# EAGLE design Gesamtschaltplan (EAGLE 7.2.0)
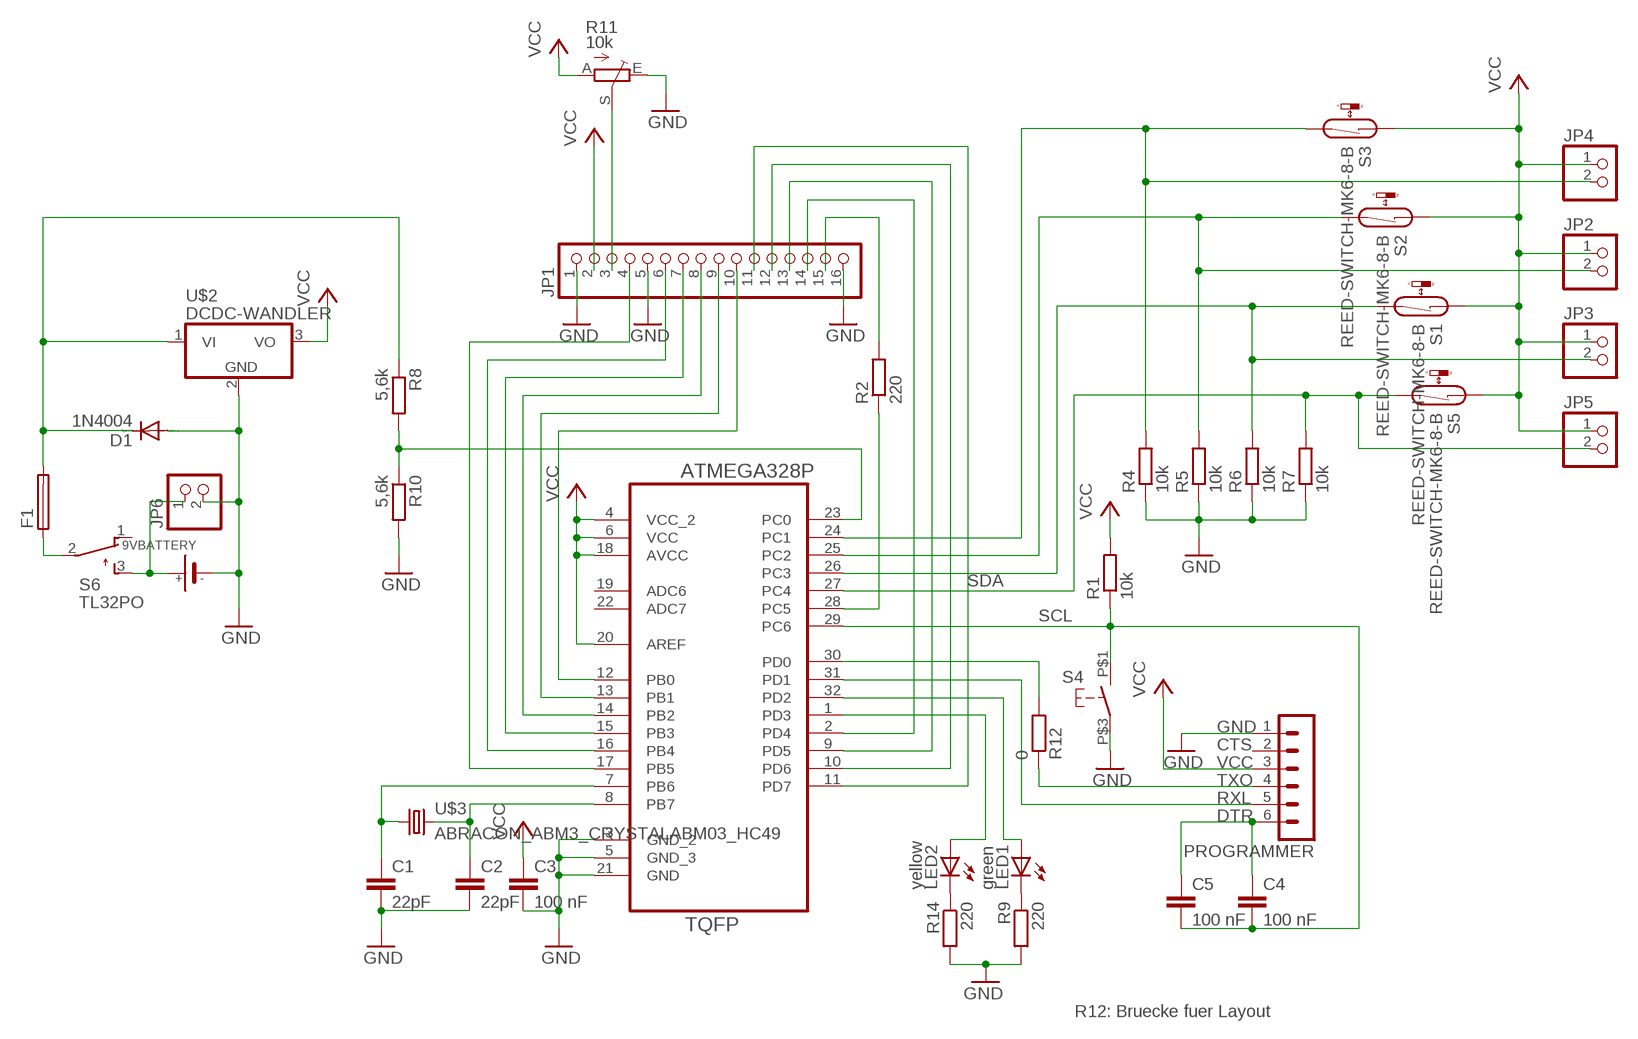
[diagram p0: schematic, sheet 1]

## Parts
C1  22pF  C-EUC0603K  [C0603K]
C2  22pF  C-EUC0603K  [C0603K]
C3  100 nF  C-EUC0603  [C0603]
C4  100 nF  C-EUC0603  [C0603]
C5  100 nF  C-EUC0603  [C0603]
D1  1N4004  [DO41-10]
F1  SH22,5A  [SH22,5A]
IC1  ATMEGA328P-AU  [QFP80P900X900X120-32N]
JP1  PINHD-1X16  [1X16]
JP2  PINHD-1X2  [1X02]
JP3  PINHD-1X2  [1X02]
JP4  PINHD-1X2  [1X02]
JP5  PINHD-1X2  [1X02]
JP6  PINHD-1X2  [1X02]
LED1  green  LED3MM  [LED3MM]
LED2  yellow  LED3MM  [LED3MM]
PROGRAMMER  MA06-1  [MA06-1]
R1  10k  R-EU_R1206  [R1206]
R2  220  R-EU_R1206  [R1206]
R4  10k  R-EU_R1206  [R1206]
R5  10k  R-EU_R1206  [R1206]
R6  10k  R-EU_R1206  [R1206]
R7  10k  R-EU_R1206  [R1206]
R8  5,6k  R-EU_R1206  [R1206]
R9  220  R-EU_R1206  [R1206]
R10  5,6k  R-EU_R1206  [R1206]
R11  10k  TRIM_EU-PT10  [PT-10]
R12  0  R-EU_R1206  [R1206]
R14  220  R-EU_R1206  [R1206]
S1  REED-SWITCH-MK6-8-B  [MK6-8-A]
S2  REED-SWITCH-MK6-8-B  [MK6-8-A]
S3  REED-SWITCH-MK6-8-B  [MK6-8-A]
S4  SCHLIESSER_TASTSCHALTER  [NAMAE-JTP-1130]
S5  REED-SWITCH-MK6-8-B  [MK6-8-A]
S6  TL32PO  [TL3XPO]
U$1  9VBATTERY  [BATTERIEHALTER-54X30]
U$2  DCDC-WANDLER  [TRACOPOWER-DCDCWANDER-TSR1]
U$3  ABRACON_ABM3_CRYSTALABM03_HC49  [ABM03_HC49]

## Nets
GND: C1.2 C2.2 C3.2 D1.A IC1.3(GND_2) IC1.5(GND_3) IC1.21(GND) JP1.1 JP1.5 JP1.16 JP6.2 PROGRAMMER.1 R4.1 R5.1 R6.1 R7.1 R9.2 R10.2 R11.E R14.2 S4.P$3 U$1.P$2 U$2.2(GND)
N$1: C4.2 C5.2 IC1.29(PC6) R1.1 S4.P$1
N$2: LED2.K(C) R14.1
N$3: C2.1 IC1.8(PB7) U$3.2
N$4: C1.1 IC1.7(PB6) U$3.1
N$5: IC1.2(PD4) JP1.14
N$6: F1.1 S6.2(P)
N$7: IC1.1(PD3) LED2.A
N$8: IC1.9(PD5) JP1.13
N$9: IC1.32(PD2) LED1.A
N$10: IC1.12(PB0) JP1.10
N$11: D1.C F1.2 R8.1 U$2.1(VI)
N$12: IC1.13(PB1) JP1.9
N$13: IC1.27(PC4) JP5.2 R7.2 S5.2
N$14: IC1.26(PC3) JP3.2 R6.2 S1.2
N$15: IC1.25(PC2) JP2.2 R5.2 S2.2
N$16: IC1.24(PC1) JP4.2 R4.2 S3.2
N$17: IC1.10(PD6) JP1.12
N$18: JP1.3 R11.S
N$19: JP6.1 S6.3(S) U$1.P$1
N$20: LED1.K(C) R9.1
N$21: IC1.11(PD7) JP1.11
N$22: PROGRAMMER.4 R12.1
N$23: IC1.14(PB2) JP1.8
N$24: IC1.15(PB3) JP1.7
N$25: IC1.16(PB4) JP1.6
N$26: IC1.17(PB5) JP1.4
N$28: IC1.23(PC0) R8.2 R10.1
N$30: C4.1 C5.1 PROGRAMMER.6
N$31: IC1.31(PD1) PROGRAMMER.5
N$44: IC1.28(PC5) R2.1
N$45: IC1.30(PD0) R12.2
N$46: JP1.15 R2.2
VCC: C3.1 IC1.4(VCC_2) IC1.6(VCC) IC1.18(AVCC) IC1.20(AREF) JP1.2 JP2.1 JP3.1 JP4.1 JP5.1 PROGRAMMER.3 R1.2 R11.A S1.1 S2.1 S3.1 S5.1 U$2.3(VO)
Unconnected: IC1.19(ADC6) IC1.22(ADC7) PROGRAMMER.2 S6.1(O)

## Notes on the sheet
- SDA
- SCL
- GND
- CTS
- VCC
- TXO
- RXL
- DTR
- R12: Bruecke fuer Layout

## Library data of the parts
C1-C5 = resistor:C-EU: CAPACITOR, European symbol
D1 = diode:1N4004: DIODE general purpose rectifier, 1 A
F1 = fuse:SH22,5A: FUSE HOLDER grid 22,5mm, isolated cap OGN0031 8201, Schurter (Buerklin); MPN: 0031.7701.11; OC_FARNELL: unknown; OC_NEWARK: 04F1224
IC1 = Ava:ATMEGA328P-AU; DESCRIPTION: 8-bit Microcontroller with In-System Programmable Flash; MPN: ATMEGA328P-AU; OC_FARNELL: 1715486; OC_NEWARK: 14R4631; PACKAGE: TQFP-32; SUPPLIER: Atmel
JP1 = pinhead:PINHD-1X16: PIN HEADER
JP2-JP6 = pinhead:PINHD-1X2: PIN HEADER
LED1 LED2 = led:LED: LED OSRAM: - CHIPLED LG R971, LG N971, LY N971, LG Q971, LY Q971, LO R971, LY R971 LH N974, LH R974 LS Q976, LO Q976, LY Q976 LO Q996 - Hyper CHIPLED LW Q18S LB Q993, LB Q99A, LB R99A - SideLED LS A670, LO A670, LY A670, LG A670, LP A670 LB A673, LV A673, LT A673, LW A673 LH A674 LY A675 LS A676, LA A676, LO A676, LY A676, LW A676 LS A679, LY A679, LG A679 - Hyper Micro SIDELED® LS Y876, LA Y876, LO Y876, LY Y876 LT Y87S - SmartLED LW L88C, LW L88S LB L89C, LB L89S, LG L890 LS L89K, LO L89K, LY L89K LS L896, LA L896, LO L896, LY L896 - TOPLED LS T670, LO T670, LY T670, LG T670, LP T670 LSG T670, LSP T670, LSY T670, LOP T670, LYG T670 LG T671, LOG T671, LSG T671 LB T673, LV T673, LT T673, LW T673 LH T674 LS T676, LA T676, LO T676, LY T676, LB T676, LH T676, LSB T676, LW T676 LB T67C, LV T67C, LT T67C, LS T67K, LO T67K, LY T67K, LW E67C LS E67B, LA E67B, LO E67B, LY E67B, LB E67C, LV E67C, LT E67C LW T67C LS T679, LY T679, LG T679 LS T770, LO T770, LY T770, LG T770, LP T770 LB T773, LV T773, LT T773, LW T773 LH T774 LS E675, LA E675, LY E675, LS T675 LS T776, LA T776, LO T776, LY T776, LB T776 LHGB T686 LT T68C, LB T68C - Hyper Mini TOPLED® LB M676 - Mini TOPLED Santana® LG M470 LS M47K, LO M47K, LY M47K Source: http://www.osram.convergy.de LUXEON: - LUMILED® LXK2-PW12-R00, LXK2-PW12-S00, LXK2-PW14-U00, LXK2-PW14-V00 LXK2-PM12-R00, LXK2-PM12-S00, LXK2-PM14-U00 LXK2-PE12-Q00, LXK2-PE12-R00, LXK2-PE12-S00, LXK2-PE14-T00, LXK2-PE14-U00 LXK2-PB12-K00, LXK2-PB12-L00, LXK2-PB12-M00, LXK2-PB14-N00, LXK2-PB14-P00, LXK2-PB14-Q00 LXK2-PR12-L00, LXK2-PR12-M00, LXK2-PR14-Q00, LXK2-PR14-R00 LXK2-PD12-Q00, LXK2-PD12-R00, LXK2-PD12-S00 LXK2-PH12-R00, LXK2-PH12-S00 LXK2-PL12-P00, LXK2-PL12-Q00, LXK2-PL12-R00 Source: www.luxeon.com KINGBRIGHT: KA-3528ASYC Source: www.kingbright.com
PROGRAMMER = con-lstb:MA06-1: PIN HEADER; OC_FARNELL: unknown; OC_NEWARK: unknown
R1 R2 R4-R10 R12 R14 = resistor:R-EU_: RESISTOR, European symbol
R11 = pot:TRIM_EU-: POTENTIOMETER
S1-S3 S5 = switch-reed:REED-SWITCH-: Reed Sensor; MF: MEDER; MPN: MK6-8-B; OC_FARNELL: 1079481
S4 = 0liver:SCHLIESSER_TASTSCHALTER: Tastschalter, Schließer
S6 = switch:TL32PO: TINY SWITCH ON - MOM Source: http://www2.produktinfo.conrad.com/datenblaetter/700000-724999/705152-da-01-de-Subminiaturschalter_TL_36YO.pdf
U$1 = 0liver:9VBATTERY
U$2 = 0liver:DCDC-WANDLER
U$3 = Ava:ABRACON_ABM3_CRYSTAL

## Board
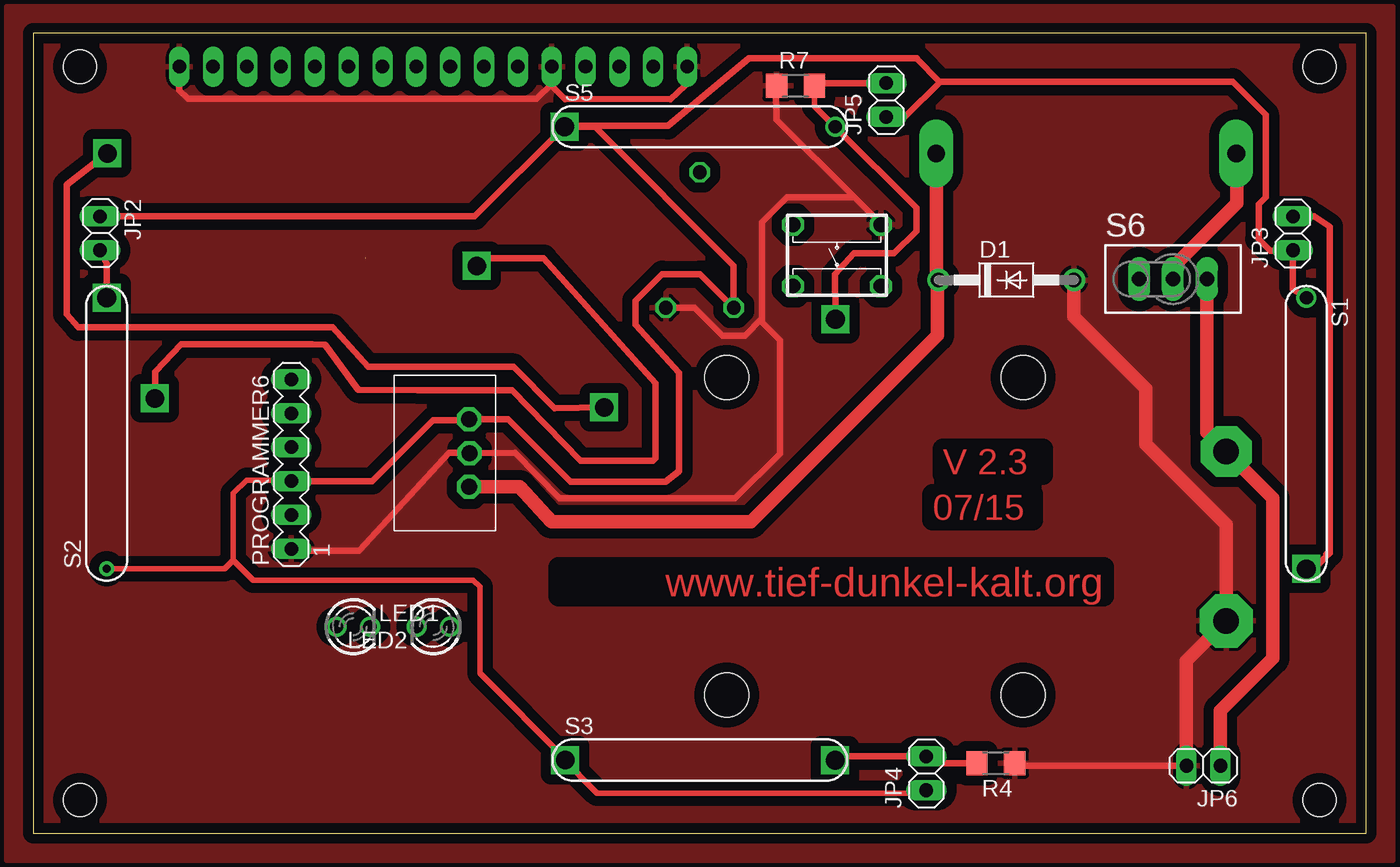
[diagram p1: board, top side]
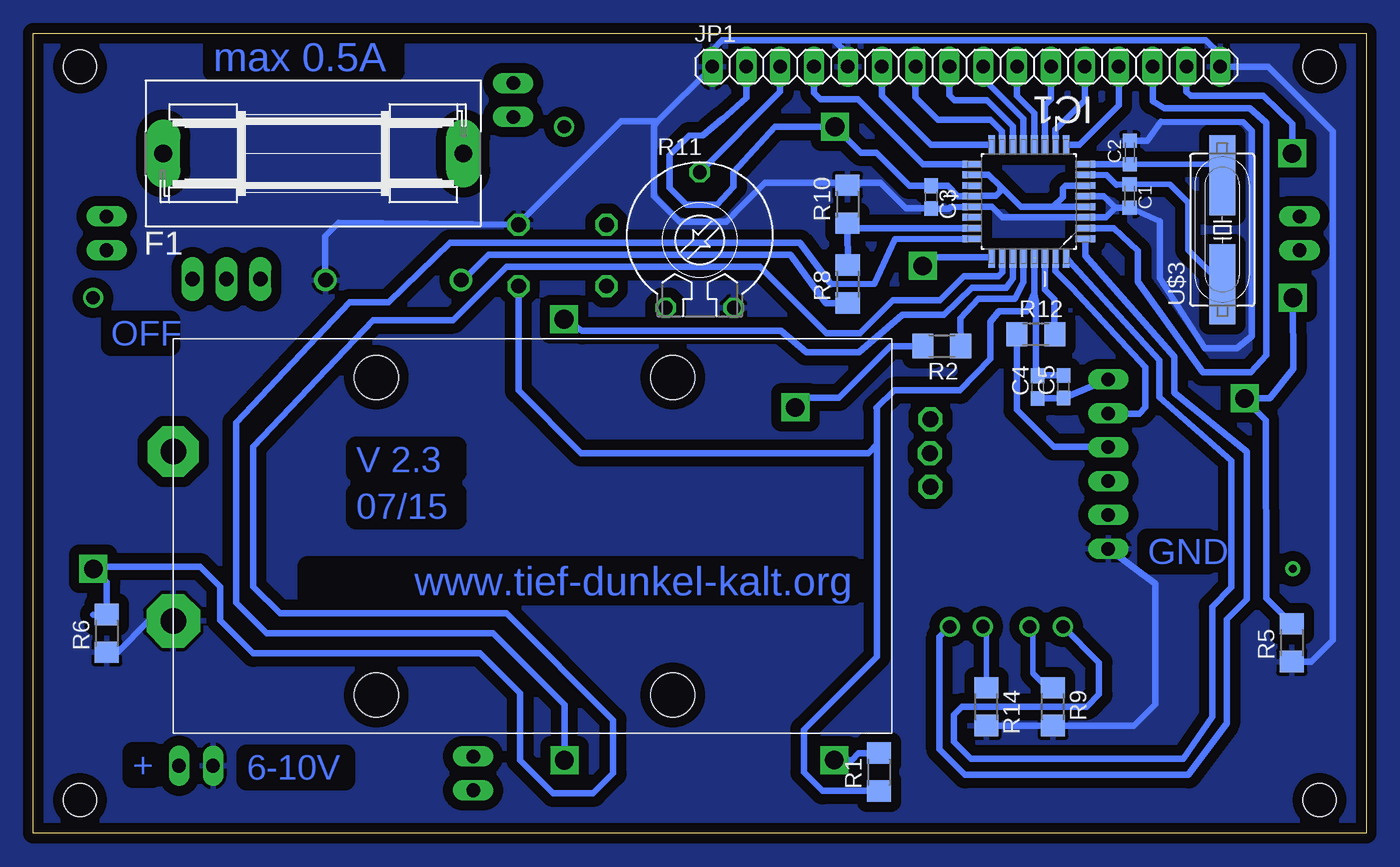
[diagram p2: board, bottom side, seen from below]

Size 100 x 60 mm. Coordinates in mm from the lower left corner, seen from the top.
Outline: 100,0 100,60 0,60 0,0 100,0
Copper layers (1*16): Top 0.035mm / dielectric 1.5mm / Bottom 0.035mm
Design rules "default *": minimum track width 10mil, minimum drill 24mil, track to track 30mil, track to pad 30mil, pad to pad 30mil, via to via 30mil, smd to smd 30mil, copper to edge 30mil, drill to drill 30mil, minimum pad ring 10mil, minimum via ring 8mil, stop-mask expansion 4mil, vias tented up to drill 0mil, thermal gap 10mil
Holes 2.5 mm at 96.5,2.5 3.5,2.5 3.5,2.5 96.5,57.5 3.5,57.5 3.5,2.5

### Footprints (pad centres in the part's own frame; a part is rotated, then mirrored left to right if it is on the bottom)
C0603K = smd 1.05 x 1.08: 1 -0.875,0; 2 0.875,0
C0603 = smd 1.1 x 1: 1 -0.85,0; 2 0.85,0
DO41-10 = drill 1.118: A 5.08,0; C -5.08,0
SH22,5A = drill 1.321 pad 2.54 long: 1 -11.252,0; 2 11.252,0
QFP80P900X900X120-32N = smd 1.473 x 0.508: 1 -4.242,2.794; 2 -4.242,2.007; 3 -4.242,1.194; 4 -4.242,0.406; 5 -4.242,-0.406; 6 -4.242,-1.194; 7 -4.242,-2.007; 8 -4.242,-2.794; 17 4.242,-2.794; 18 4.242,-2.007; 19 4.242,-1.194; 20 4.242,-0.406; 21 4.242,0.406; 22 4.242,1.194; 23 4.242,2.007; 24 4.242,2.794 | smd 0.508 x 1.473: 9 -2.794,-4.242; 10 -2.007,-4.242; 11 -1.194,-4.242; 12 -0.406,-4.242; 13 0.406,-4.242; 14 1.194,-4.242; 15 2.007,-4.242; 16 2.794,-4.242; 25 2.794,4.242; 26 2.007,4.242; 27 1.194,4.242; 28 0.406,4.242; 29 -0.406,4.242; 30 -1.194,4.242; 31 -2.007,4.242; 32 -2.794,4.242
1X16 = drill 1.016 long: 1 -19.05,0; 2 -16.51,0; 3 -13.97,0; 4 -11.43,0; 5 -8.89,0; 6 -6.35,0; 7 -3.81,0; 8 -1.27,0; 9 1.27,0; 10 3.81,0; 11 6.35,0; 12 8.89,0; 13 11.43,0; 14 13.97,0; 15 16.51,0; 16 19.05,0
1X02 = drill 1.016 long: 1 -1.27,0; 2 1.27,0
LED3MM = drill 0.813 octagon: A -1.27,0; K 1.27,0
MA06-1 = drill 1.016 long: 1 -6.35,0; 2 -3.81,0; 3 -1.27,0; 4 1.27,0; 5 3.81,0; 6 6.35,0
R1206 = smd 1.6 x 1.803: 1 -1.422,0; 2 1.422,0
PT-10 = drill 1.016 octagon: A -2.54,-5.08; E 2.54,-5.08; S 0,5.08
MK6-8-A = drill 0.6 pad 1.016: 1 -10.16,0; 2 10.16,0
NAMAE-JTP-1130 = drill 1.1 octagon: P$1 3.3,-2.3; P$2 -3.3,-2.3; P$3 3.3,2.3; P$4 -3.3,2.3
TL3XPO = drill 1.1 pad 1.422 long: 1 -2.54,0; 2 0,0; 3 2.54,0
BATTERIEHALTER-54X30 = drill 1.92 pad 3.81 octagon: P$1 0,21.135 | drill 1.92 pad 4 octagon: P$2 0,8.435 | hole 3.3: 15.24,2.87; 37.47,2.87; 15.24,26.7; 37.47,26.7
TRACOPOWER-DCDCWANDER-TSR1 = drill 0.6 square: 1 0,0; 2 2.54,0; 3 5.08,0
ABM03_HC49 = smd 6 x 1.93: 1 -4.1,0; 2 4.1,0

### Placement (x,y rotation side)
C1  17.75,47.81 270 bottom
C2  17.73,51.06 90 bottom
C3  32.64,47.72 270 bottom
C4  24.65,33.47 90 bottom
C5  22.71,33.5 90 bottom
D1  73,41.5 0 top
F1  79,51 0 bottom
IC1  25.31,47.39 180 bottom
JP1  30,57.5 0 bottom
JP2  5.01,45 270 top
JP3  94.5,45 90 top
JP4  67,4.5 90 top
JP5  64,55 90 top
JP6  87.79,5.07 180 top
LED1  24,15.5 0 top
LED2  30,15.5 180 top
PROGRAMMER  19.35,27.69 90 top
R1  36.56,4.6 90 bottom
R2  31.84,36.55 180 bottom
R4  72.21,5.27 180 top
R5  5.58,14.3 90 bottom
R6  94.49,15 90 bottom
R7  57.19,56.06 0 top
R8  38.9,41.2 90 bottom
R9  23.5,9.5 270 bottom
R10  38.91,47.18 90 bottom
R11  50,44.5 0 bottom
R12  24.78,37.42 0 bottom
R14  28.5,9.5 270 bottom
S1  95.5,30 270 top
S2  5.5,30 90 top
S3  50,5.5 0 top
S4  60.29,43.34 0 top
S5  50,53 0 top
S6  85.51,41.57 0 top
U$1  89.5,7.5 0 bottom
U$2  32.69,25.98 90 top
U$3  10.79,45.27 90 bottom

### Tracks (layer width: path | path; a pad name or v marks a point on that pad's centre or on a via)
GND
  Top 0.5: S4.P$3 63.52,45.78 61.61,47.69 | 61.61,47.69 55.77,53.53 55.72,55.93 R7.1 | PROGRAMMER.1 19.49,21.2 24.43,21.2 31.19,28.54 32.69,28.54 U$2.2 32.66,28.52 36.16,28.54 39.49,25.12 52.65,25.12 56,28.47 56,37 54.68,38.32 54.68,38.63 | R11.E 49.62,39.42 51.71,37.33 53.38,37.33 54.68,38.63 | 54.68,38.63 54.68,45.84 56.53,47.69 61.61,47.69 | 10.95,57.37 10.95,55.75 11.62,55.08 37.75,55.08 38.9,56.23 38.9,56.03 39.89,55.04 | R4.1 73.83,5.07 JP6.2
  Top 1: D1.A 78.07,38.74 83.48,33.33 83.48,29.17 89.5,23.15 U$1.P$2 86.52,12.96 JP6.2
  Bottom 0.5: 18.82,46.94 C1.2 15.47,45.91 15.48,41.63 12.11,36.37 9.7,36.37 8.6,37.27 8.6,52.68 9.23,53.33 15.41,53.36 16.43,51.94 C2.2 | 18.82,46.94 19.55,46.2 IC1.3 27.29,46.2 28.08,46.98 29.54,46.98 IC1.21 31.21,46.97 31.33,46.86 C3.2 34.54,46.87 36.45,48.78 37.72,48.78 | IC1.5 19.68,47.8 18.82,46.94 | R14.2 R9.2 17.44,8.08 15.82,9.7 15.82,18.71 PROGRAMMER.1 | JP1.5 38.89,58.45 39.92,59.48 40.05,59.48 | 40.05,59.48 48.32,59.48 49.05,58.75 JP1.1 53.16,53.39 | 37.72,48.78 R10.2 | U$1.P$2 91.33,15.94 93.68,13.59 94.55,13.62 R6.1 | 53.16,53.39 55.91,53.39 63.52,45.78 S4.P$3 77.11,45.78 78.11,44.78 78.11,41.53 D1.A | 37.72,48.78 45.12,48.78 47.44,46.46 47.44,46.42 47.99,45.87 51.52,45.87 53.45,47.8 53.45,53.1 53.16,53.39 | 40.05,59.48 39.78,59.47 12.03,59.47 10.95,58.43 JP1.16 7.35,57.5 2.5,52.65 2.5,14.5 4.12,12.88 R5.1
  pour Top: -5,65 105,65 105,-5 -5,-5
  pour Bottom: -4,64 104,64 104,-4 -4,-4
N$1  (1 unrouted)
  Bottom 0.5: R1.1 40.79,3.18 42.2,4.59 42.19,4.6 42.19,7.77 36.7,13.26 36.7,29.18 | 24.89,40.45 24.79,39.89 24.77,34.3 24.73,34.63 C4.2 24.62,34.35 C5.2 | 24.89,40.45 24.95,40.42 25.45,39.17 27.56,39.17 28.19,38.36 28.19,35.61 30.48,33.22 35.41,33.22 36.76,31.93 36.7,31.93 36.7,29.18 | 36.7,29.18 37.36,28.52 58.9,28.52 63.6,33.22 S4.P$1 | IC1.29 24.89,40.45
N$2
  Bottom 0.406: R14.1 28.5,15.27 LED2.K
N$3
  Bottom 0.406: C2.1 10.94,50.18 10.92,50.2 10.92,49.5 U$3.2
  Bottom 0.5: IC1.8 C2.1
N$4
  Bottom 0.406: C1.1 14.75,48.68 13.39,47.32 13.39,43.77 U$3.1
  Bottom 0.5: IC1.7 19.45,49.37 18.73,48.65 C1.1
N$5
  Bottom 0.5: IC1.2 18.92,45.38 17.13,43.69 17.13,41.36 12.24,34.58 8.64,34.6 7.5,35.85 7.5,53.29 8.72,54.39 15.15,54.39 16.01,54.9 16.01,57.48 JP1.14
N$6
  Top 1: S6.2 85.51,42.46 90.3,47.25 90.3,50.95 F1.1
N$7
  Bottom 0.5: IC1.1 21.07,43.31 14.41,35.73 14.41,33.06 8.97,28.62 8.97,17.56 10.46,16.07 10.46,8.26 13.34,4.38 30.09,4.38 32.01,6.3 32.01,14.76 LED2.A
N$8
  Bottom 0.5: IC1.9 21.53,51.63 18.56,54.6 JP1.13
N$9
  Bottom 0.5: IC1.32 22.31,42.94 15.53,35.5 15.53,32.71 10.11,27.94 10.11,18.46 11.56,17.01 11.56,8.74 13.72,5.58 29.66,5.58 30.94,6.86 30.94,8.88 30.32,9.5 20.96,9.5 20.04,10.42 20.04,12.81 LED1.A
N$10
  Bottom 0.5: IC1.12 24.9,54.01 26.2,55.31 JP1.10
N$11  (via drill 0.6)
  Top 0.5: F1.2 67.75,41.57 v67.84,41.48
  Top 1: F1.2 67.75,41.67 D1.C | U$2.1 36.48,26 38.89,23.37 53.85,23.37 67.84,37.36 v67.84,41.48
  Bottom 0.5: v67.84,41.48 67.76,41.48 65.86,43.39 43.19,43.39 40.52,39.74 38.68,39.74 R8.1
N$12
  Bottom 0.5: IC1.13 25.72,53.59 28.73,56.6 JP1.9
N$13  (via drill 1.4)
  Top 0.406: R7.2 58.61,54.55 S5.2
  Top 0.5: R7.2 58.67,56.26 JP5.2 | v60.18,38.56 60.14,41.93 61.56,43.49 64.56,43.49 66.24,45.17 66.24,46.92 S5.2
  Bottom 0.5: IC1.27 26.5,41.62 27,40.92 29.57,40.92 31.7,38.9 34.78,38.9 38.05,36.1 42.01,36.1 43.9,37.7 58.83,37.68 v60.18,38.56
N$14
  Top 0.5: 95.75,20.09 S1.2 96.14,19.85 96.94,20.72 97.25,21 | 97,20.93 97.25,21 | 97.25,21 97.25,45.5 96.12,46.27 JP3.2
  Bottom 0.5: 95.5,16.41 R6.2 94.49,18.83 S1.2 95.34,20 87.5,20 86,18.5 86,16 83.5,13.5 66.5,13.5 63.5,10.5 63.5,5.5 61,3 58,3 56.5,4.5 56.5,8.5 64.5,16.5 81.5,16.5 83.5,18.5 83.5,29 74.5,38.5 68.5,38.5 64.5,42.5 45.5,42.5 40.5,37.5 38,37.5 35.5,40 32,40 30.2,41.8 27.6,41.8 27.3,42.1 27.3,43.13 IC1.26
N$15  (via drill 1.4)
  Top 0.5: S2.2 v5.5,40.17 5.5,42.73 JP2.2 | v9.12,32.62 9.15,34.63 11.08,36.68 20.9,36.68 21.88,36.66 24.38,33.27 28.84,33.22 35.91,33.22 41.04,27.95 46.49,27.95 46.68,28.14 46.68,33.75 38.29,43.14 32.88,43.14 v33.27,42.56
  Bottom 0.5: v5.5,40.17 5.48,34.83 7.22,32.62 v9.12,32.62 v9.13,32.61 7.55,30.99 7.5,17.64 R5.2 | IC1.25 28.15,43.19 32.26,43.19 v33.27,42.56 | 5.5,40.22 v5.5,40.17 | v5.5,40.17 S2.2
N$16
  Top 0.5: S3.2 60.43,5.77 JP4.2 67.5,5.27 R4.2
  Bottom 0.5: S3.2 60.16,9.66 65.5,15 82.5,15 84.79,17.29 84.79,30.81 76.27,39.83 73.36,39.83 68.75,44.28 42.49,44.28 40.15,41.2 36.9,41.21 35.35,44.56 IC1.24
N$17
  Bottom 0.5: IC1.10 23.3,52.81 23.29,52.82 23.27,52.82 21.1,54.99 JP1.12
N$18
  Bottom 0.5: JP1.3 43.97,55.61 R11.S
N$19
  Top 1: S6.3 88.05,30.09 U$1.P$1 93,25.14 93,13.15 89.06,9.21 JP6.1
N$20
  Bottom 0.406: R9.1 23.92,10.92 25,12 25,15.23 LED1.K
N$21
  Bottom 0.5: IC1.11 24.12,54.62 23.67,55.07 23.67,57.48 JP1.11
N$22
  Bottom 0.5: R12.1 26.22,31.77 23.44,28.99 19.38,28.99 PROGRAMMER.4
N$23
  Bottom 0.5: IC1.14 26.5,53.02 28.45,54.97 30.9,54.97 31.27,55.34 JP1.8
N$24
  Bottom 0.5: IC1.15 27.32,52.65 28.19,53.52 32.14,53.52 33.81,55.19 JP1.7
N$25
  Bottom 0.5: IC1.16 32.66,51.63 36.35,55.32 JP1.6
N$26
  Bottom 0.5: IC1.17 33.27,50.18 38.15,55.06 40.95,55.06 41.44,55.55 JP1.4
N$27
  pour Top: -2,-2 -2,62 102,62 102,-2
N$28
  Bottom 0.5: R8.2 38.9,42.34 R10.1 38.23,45.38 IC1.23
N$30
  Bottom 0.5: PROGRAMMER.6 C5.1 24.66,32.65 24.63,32.62 C4.1
N$31
  Bottom 0.5: IC1.31 23.3,42.17 22.03,40.9 22.03,40.88 16.58,34.95 16.58,31.94 17.02,31.46 19.9,31.46 19.93,31.43 19.42,31.43 PROGRAMMER.5
N$32
  pour Bottom: -6,-6 -6,66 106,66 106,-6
N$33  (via drill 1.4)
  other vias: 95.5,19.83
N$34  (via drill 1.4)
  other vias: 39.86,52.99
N$35  (via drill 1)
  other vias: 60.17,53
N$36  (via drill 1.4)
  other vias: 60.16,5.48
N$37  (via drill 1)
  other vias: 95.52,40.17
N$38  (via drill 1)
  other vias: 31.25,15.49
N$39  (via drill 1)
  other vias: 28.76,15.51
N$41  (via drill 1)
  other vias: 25.26,15.5
N$42
  Top 0.5: 40.02,55.08 47.8,55.07 48.88,56.06
N$43  (via drill 1)
  other vias: 22.75,15.5
N$44
  Bottom 0.5: IC1.28 25.72,41.31 26.36,40.09 29.1,40.09 30.44,38.63 R2.1
N$45
  Bottom 0.5: IC1.30 24.12,40.78 23.38,40.04 23.38,38.52 R12.2
N$46  (via drill 1.4)
  Top 0.5: v42.83,31.94 39.12,31.9 36.04,34.98 25.12,34.98 22.47,37.95 3.36,37.95 2.5,38.95 2.5,48.64 v5.56,51
  Bottom 0.5: v5.56,51 5.55,53.22 7.72,55.31 13.16,55.31 13.49,55.61 JP1.15 | R2.2 35.68,36.55 39.56,32.67 42.31,32.67 v42.83,31.94
N$48  (via drill 1.2)
  other vias: 32.71,31.07
N$49  (via drill 1.2)
  other vias: 32.72,28.52
N$51  (via drill 1.2)
  other vias: 32.71,25.98
VCC  (via drill 0.6, 1.4)
  Top 0.406: 42.06,3.24 42.3,3 66.5,3 JP4.1 | v40,5.5 33.5,12 33.5,18.5 33,19 16.5,19 15,20.5 | 15,20.5 15,25.5 16,26.5 19.27,26.5 PROGRAMMER.3 | 15,20.5 14.34,19.84 S2.1
  Top 0.5: S1.1 94.5,40.82 JP3.1 94.48,43.71 92.79,43.71 91.94,44.56 91.94,47.17 92.46,47.69 92.46,53.91 89.99,56.38 68.06,56.38 65.41,53.73 JP5.1 65.4,53.73 68.05,56.38 67.99,56.38 66.31,58.11 66.28,58.15 65.06,58.14 53.69,58.14 53.24,57.76 52.55,57.21 47.61,53.06 39.9,53.06 S5.1 | 42.06,3.24 S3.1 | 39.82,52.98 S5.1 | S5.1 39.86,52.98 42.14,52.98 52.54,42.58 R11.A 50.01,41.95 47.18,41.95 45.19,39.96 45.19,38.16 48.45,34.56 48.45,27.17 47.42,26.37 40.32,26.37 35.63,31.06 U$2.3 32.63,31 30,31 25.42,26.42 PROGRAMMER.3 | JP2.1 33.11,46.27 S5.1
  Bottom 0.406: 38.59,5.5 v40,5.5
  Bottom 0.5: IC1.4 23.49,46.98 | 23.49,46.98 25.91,46.98 27.45,48.52 | 27.45,48.52 27.45,48.16 27.8,47.81 29.54,47.81 IC1.20 30.63,47.8 31.4,48.57 C3.1 34.28,48.57 36.76,51.05 37.89,51.05 S5.1 39.86,52.98 44.37,52.98 47.46,49.59 47.46,48.5 48.71,47.16 51.01,47.16 52.26,48.43 52.26,50.87 50.79,52.32 49.76,52.34 48.35,53.54 48.3,53.56 46.51,55.18 JP1.2 | IC1.18 28.33,49.4 27.45,48.52 | IC1.6 22.58,48.58 22.76,48.4 22.76,47.71 23.49,46.98 | S3.1 v39.91,5.49 38.59,5.5 38.08,6.01 37.57,6.01 R1.2

### Text on the board
Top: V 2.3 | 07/15 | www.tief-dunkel-kalt.org
Bottom: max 0.5A | OFF | V 2.3 | 07/15 | GND | www.tief-dunkel-kalt.org | 6-10V | +